# Altium schematic sheet [02] - TABLE OF CONTENTS_ASCII.SchDoc: Table of Contents
size Letter; SheetNumber: 2; SheetTotal: 4
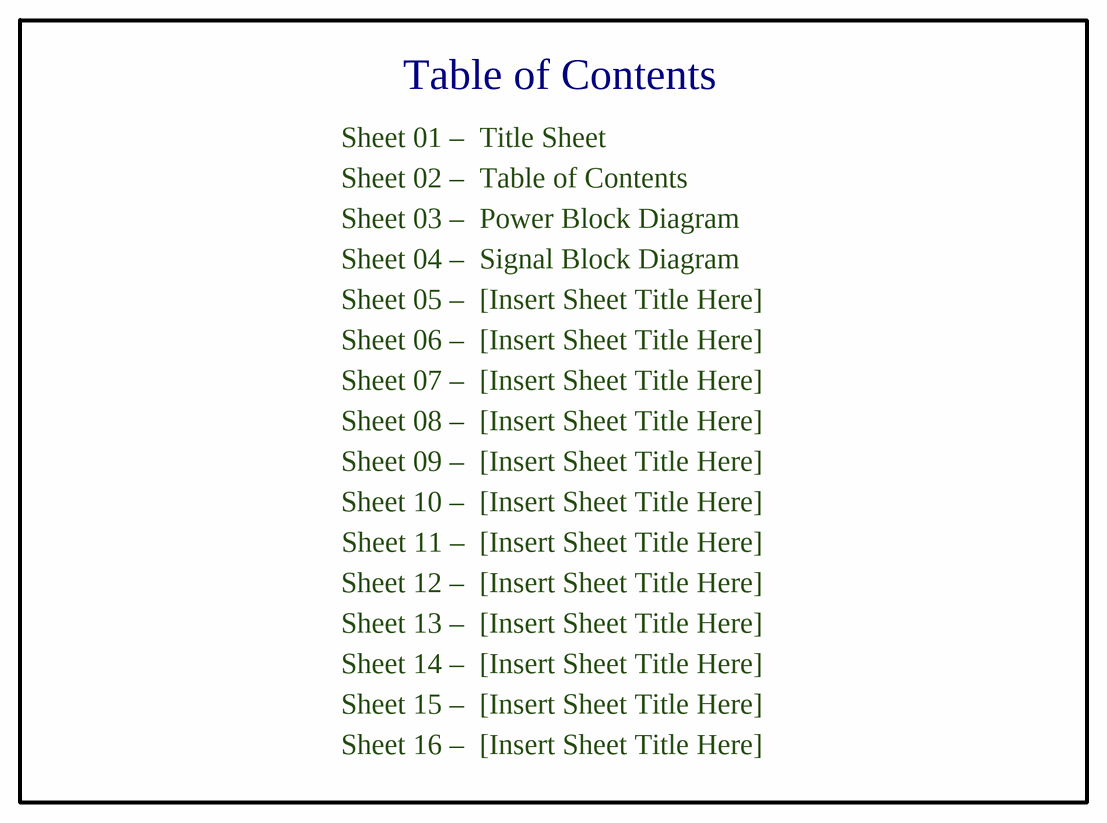
[diagram p0: [02] - TABLE OF CONTENTS_ASCII.SchDoc]

## Sub-sheets
[03] - POWER BLOCK DIAGRAM = [03] - POWER BLOCK DIAGRAM_ASCII.SchDoc: no entries

## Notes on the sheet
- Table of Contents
- Sheet 01 –
- Title Sheet
- Sheet 02 –
- Sheet 03 –
- Sheet 04 –
- Power Block Diagram
- Signal Block Diagram
- Sheet 05 –
- Sheet 06 –
- [Insert Sheet Title Here]
- Sheet 07 –
- Sheet 08 –
- Sheet 09 –
- Sheet 10 –
- Sheet 11 –
- Sheet 12 –
- Sheet 13 –
- Sheet 14 –
- Sheet 15 –
- Sheet 16 –
- CONFIDENTIALITY NOTICE. THIS DRAWING AND INFORMATION CONTAINED HEREIN ARE THE EXCLUSIVE PROPERTY OF [[INSERT COMPANY NAME]]. NEITHER THIS DESIGN NOR ANY INFORMATION CONTAINED IN THIS DRAWING MAY BE REPRODUCED OR DISCLOSED WITHOUT THE EXPRESS WRITTEN CONSENT OF [[INSERT COMPANY NAME]].
- PCB Part Number:
- PCB Rev.:
- PCB Variant:
- Replaces PCB P/N & Rev.:
- SHEET TITLE:
- SIZE
- A
- Time Stamp:
- Doc. No.:
- Doc. Rev.:
- Doc. Status:
- Sheet
- of